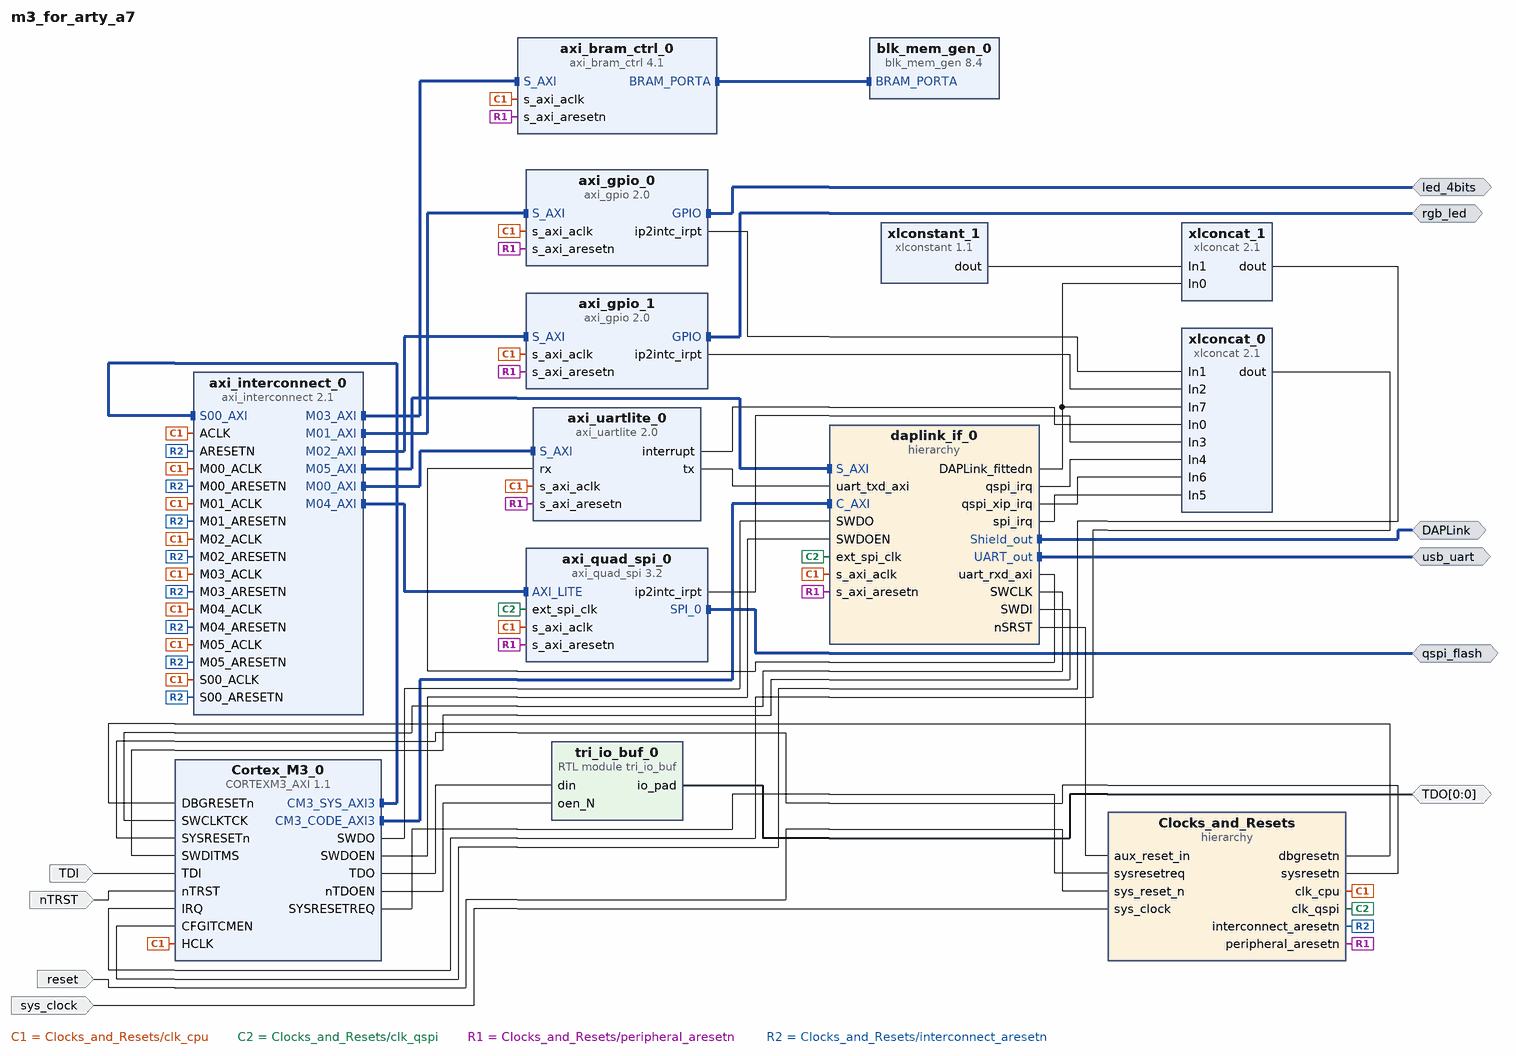
[diagram p0: block diagram of the top level]
# Vivado block design m3_for_arty_a7, xck26-sfvc784-2LV-c, Vivado 2024.2
create_bd_design m3_for_arty_a7

create_bd_intf_port -mode Master -vlnv xilinx.com:interface:gpio_rtl:1.0 DAPLink
create_bd_intf_port -mode Master -vlnv xilinx.com:interface:gpio_rtl:1.0 led_4bits
create_bd_intf_port -mode Master -vlnv xilinx.com:interface:spi_rtl:1.0 qspi_flash
create_bd_intf_port -mode Master -vlnv xilinx.com:interface:gpio_rtl:1.0 rgb_led
create_bd_intf_port -mode Master -vlnv xilinx.com:interface:uart_rtl:1.0 usb_uart
create_bd_port -dir IO -from 0 -to 0 TDO
create_bd_port -dir I -type clk sys_clock
set_property -dict {CONFIG.FREQ_HZ 100000000 CONFIG.PHASE 0.000} [get_bd_ports sys_clock]
create_bd_port -dir I TDI
create_bd_port -dir I nTRST
create_bd_port -dir I -type rst reset
set_property -dict {CONFIG.POLARITY ACTIVE_LOW} [get_bd_ports reset]

create_bd_cell -type hier Clocks_and_Resets
create_bd_cell -type ip -vlnv xilinx.com:ip:axi_bram_ctrl:4.1 axi_bram_ctrl_0
set_property -dict {CONFIG.PROTOCOL AXI4LITE CONFIG.SINGLE_PORT_BRAM 1} [get_bd_cells axi_bram_ctrl_0]
create_bd_cell -type ip -vlnv xilinx.com:ip:axi_gpio:2.0 axi_gpio_0
set_property -dict [list \
  CONFIG.C_INTERRUPT_PRESENT 1 \
  CONFIG.GPIO2_BOARD_INTERFACE Custom \
  CONFIG.GPIO_BOARD_INTERFACE Custom \
  CONFIG.USE_BOARD_FLOW true \
] [get_bd_cells axi_gpio_0]
create_bd_cell -type ip -vlnv xilinx.com:ip:axi_gpio:2.0 axi_gpio_1
set_property -dict [list \
  CONFIG.C_INTERRUPT_PRESENT 1 \
  CONFIG.GPIO2_BOARD_INTERFACE Custom \
  CONFIG.GPIO_BOARD_INTERFACE Custom \
  CONFIG.USE_BOARD_FLOW true \
] [get_bd_cells axi_gpio_1]
create_bd_cell -type ip -vlnv xilinx.com:ip:axi_interconnect:2.1 axi_interconnect_0
set_property -dict [list \
  CONFIG.ENABLE_ADVANCED_OPTIONS 1 \
  CONFIG.M00_HAS_DATA_FIFO 0 \
  CONFIG.M00_HAS_REGSLICE 0 \
  CONFIG.M00_SECURE 0 \
  CONFIG.M01_HAS_DATA_FIFO 0 \
  CONFIG.M01_HAS_REGSLICE 3 \
  CONFIG.M01_SECURE 0 \
  CONFIG.M02_HAS_REGSLICE 3 \
  CONFIG.M02_SECURE 0 \
  CONFIG.M03_HAS_REGSLICE 3 \
  CONFIG.M04_HAS_REGSLICE 3 \
  CONFIG.M05_HAS_REGSLICE 3 \
  CONFIG.NUM_MI 6 \
  CONFIG.NUM_SI 1 \
  CONFIG.S00_HAS_REGSLICE 3 \
  CONFIG.S01_HAS_DATA_FIFO 1 \
  CONFIG.S01_HAS_REGSLICE 3 \
  CONFIG.SYNCHRONIZATION_STAGES 2 \
] [get_bd_cells axi_interconnect_0]
create_bd_cell -type ip -vlnv xilinx.com:ip:axi_quad_spi:3.2 axi_quad_spi_0
set_property -dict [list \
  CONFIG.C_FAMILY artix7 \
  CONFIG.C_FIFO_DEPTH 256 \
  CONFIG.C_SUB_FAMILY artix7 \
  CONFIG.C_USE_STARTUP 1 \
  CONFIG.QSPI_BOARD_INTERFACE Custom \
  CONFIG.UC_FAMILY 0 \
  CONFIG.USE_BOARD_FLOW true \
] [get_bd_cells axi_quad_spi_0]
create_bd_cell -type ip -vlnv xilinx.com:ip:axi_uartlite:2.0 axi_uartlite_0
set_property -dict [list \
  CONFIG.C_BAUDRATE 115200 \
  CONFIG.C_S_AXI_ACLK_FREQ_HZ 50000000 \
  CONFIG.UARTLITE_BOARD_INTERFACE Custom \
  CONFIG.USE_BOARD_FLOW true \
] [get_bd_cells axi_uartlite_0]
create_bd_cell -type ip -vlnv xilinx.com:ip:blk_mem_gen:8.4 blk_mem_gen_0
set_property -dict {CONFIG.EN_SAFETY_CKT false} [get_bd_cells blk_mem_gen_0]
create_bd_cell -type hier daplink_if_0
create_bd_cell -type module -reference tri_io_buf tri_io_buf_0
create_bd_cell -type ip -vlnv xilinx.com:ip:xlconcat:2.1 xlconcat_0
set_property -dict {CONFIG.NUM_PORTS 8 CONFIG.dout_width 8} [get_bd_cells xlconcat_0]
create_bd_cell -type ip -vlnv xilinx.com:ip:xlconcat:2.1 xlconcat_1
set_property -dict {CONFIG.IN6_WIDTH 25 CONFIG.NUM_PORTS 2} [get_bd_cells xlconcat_1]
create_bd_cell -type ip -vlnv xilinx.com:ip:xlconstant:1.1 xlconstant_1
set_property -dict {CONFIG.CONST_VAL 1 CONFIG.CONST_WIDTH 1} [get_bd_cells xlconstant_1]
create_bd_cell -type ip -vlnv Arm.com:CortexM:CORTEXM3_AXI:1.1 Cortex_M3_0
set_property -dict [list \
  CONFIG.DEBUG_LVL 2 \
  CONFIG.DTCM_SIZE {"1011"} \
  CONFIG.ITCM_INIT_FILE bram_a7.hex \
  CONFIG.ITCM_SIZE {"1011"} \
  CONFIG.TRACE_LVL 1 \
  CONFIG.WIC_PRESENT false \
] [get_bd_cells Cortex_M3_0]

# ---- hierarchy /Clocks_and_Resets ----
current_bd_instance /Clocks_and_Resets
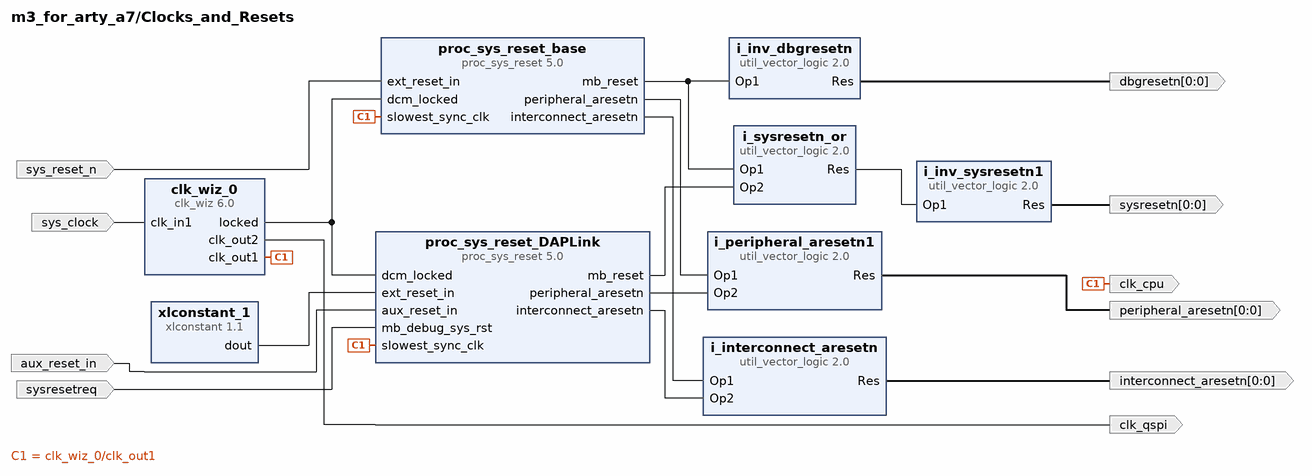
[diagram p1: block diagram inside /Clocks_and_Resets]
create_bd_pin -dir I -type rst aux_reset_in
create_bd_pin -dir O -from 0 -to 0 -type rst interconnect_aresetn
create_bd_pin -dir O -from 0 -to 0 -type rst peripheral_aresetn
create_bd_pin -dir O -type clk clk_cpu
create_bd_pin -dir I -type clk sys_clock
create_bd_pin -dir O -from 0 -to 0 sysresetn
create_bd_pin -dir O -from 0 -to 0 dbgresetn
create_bd_pin -dir O clk_qspi
create_bd_pin -dir I sysresetreq
create_bd_pin -dir I -type rst sys_reset_n

create_bd_cell -type ip -vlnv xilinx.com:ip:proc_sys_reset:5.0 proc_sys_reset_DAPLink
set_property -dict [list \
  CONFIG.C_AUX_RST_WIDTH 1 \
  CONFIG.C_EXT_RST_WIDTH 1 \
  CONFIG.RESET_BOARD_INTERFACE Custom \
  CONFIG.USE_BOARD_FLOW true \
] [get_bd_cells proc_sys_reset_DAPLink]
create_bd_cell -type ip -vlnv xilinx.com:ip:proc_sys_reset:5.0 proc_sys_reset_base
create_bd_cell -type ip -vlnv xilinx.com:ip:util_vector_logic:2.0 i_interconnect_aresetn
set_property -dict {CONFIG.C_SIZE 1} [get_bd_cells i_interconnect_aresetn]
create_bd_cell -type ip -vlnv xilinx.com:ip:util_vector_logic:2.0 i_peripheral_aresetn1
set_property -dict {CONFIG.C_SIZE 1} [get_bd_cells i_peripheral_aresetn1]
create_bd_cell -type ip -vlnv xilinx.com:ip:util_vector_logic:2.0 i_sysresetn_or
set_property -dict {CONFIG.C_OPERATION or CONFIG.C_SIZE 1} [get_bd_cells i_sysresetn_or]
create_bd_cell -type ip -vlnv xilinx.com:ip:util_vector_logic:2.0 i_inv_dbgresetn
set_property -dict {CONFIG.C_OPERATION not CONFIG.C_SIZE 1} [get_bd_cells i_inv_dbgresetn]
create_bd_cell -type ip -vlnv xilinx.com:ip:util_vector_logic:2.0 i_inv_sysresetn1
set_property -dict {CONFIG.C_OPERATION not CONFIG.C_SIZE 1} [get_bd_cells i_inv_sysresetn1]
create_bd_cell -type ip -vlnv xilinx.com:ip:clk_wiz:6.0 clk_wiz_0
set_property -dict [list \
  CONFIG.CLKIN1_JITTER_PS 833.33 \
  CONFIG.CLKIN2_JITTER_PS 833.33 \
  CONFIG.CLKOUT1_DRIVES BUFGCE \
  CONFIG.CLKOUT1_JITTER 151.636 \
  CONFIG.CLKOUT1_PHASE_ERROR 98.575 \
  CONFIG.CLKOUT1_REQUESTED_OUT_FREQ 50.0 \
  CONFIG.CLKOUT2_DRIVES BUFGCE \
  CONFIG.CLKOUT2_JITTER 151.636 \
  CONFIG.CLKOUT2_PHASE_ERROR 98.575 \
  CONFIG.CLKOUT2_REQUESTED_OUT_FREQ 50.0 \
  CONFIG.CLKOUT2_USED true \
  CONFIG.CLKOUT3_DRIVES BUFGCE \
  CONFIG.CLKOUT4_DRIVES BUFGCE \
  CONFIG.CLKOUT5_DRIVES BUFGCE \
  CONFIG.CLKOUT6_DRIVES BUFGCE \
  CONFIG.CLKOUT7_DRIVES BUFGCE \
  CONFIG.CLK_IN1_BOARD_INTERFACE sys_clock \
  CONFIG.CLK_IN2_BOARD_INTERFACE Custom \
  CONFIG.FEEDBACK_SOURCE FDBK_AUTO \
  CONFIG.MMCM_CLKFBOUT_MULT_F 12.000 \
  CONFIG.MMCM_CLKIN1_PERIOD 10.000 \
  CONFIG.MMCM_CLKIN2_PERIOD 10.000 \
  CONFIG.MMCM_CLKOUT0_DIVIDE_F 24.000 \
  CONFIG.MMCM_CLKOUT1_DIVIDE 24 \
  CONFIG.MMCM_COMPENSATION AUTO \
  CONFIG.MMCM_DIVCLK_DIVIDE 1 \
  CONFIG.NUM_OUT_CLKS 2 \
  CONFIG.PHASESHIFT_MODE WAVEFORM \
  CONFIG.RESET_BOARD_INTERFACE Custom \
  CONFIG.SECONDARY_SOURCE Single_ended_clock_capable_pin \
  CONFIG.USE_BOARD_FLOW true \
  CONFIG.USE_INCLK_SWITCHOVER false \
  CONFIG.USE_PHASE_ALIGNMENT true \
  CONFIG.USE_RESET false \
  CONFIG.USE_SAFE_CLOCK_STARTUP true \
] [get_bd_cells clk_wiz_0]
create_bd_cell -type ip -vlnv xilinx.com:ip:xlconstant:1.1 xlconstant_1

# ---- hierarchy /daplink_if_0 ----
current_bd_instance /daplink_if_0
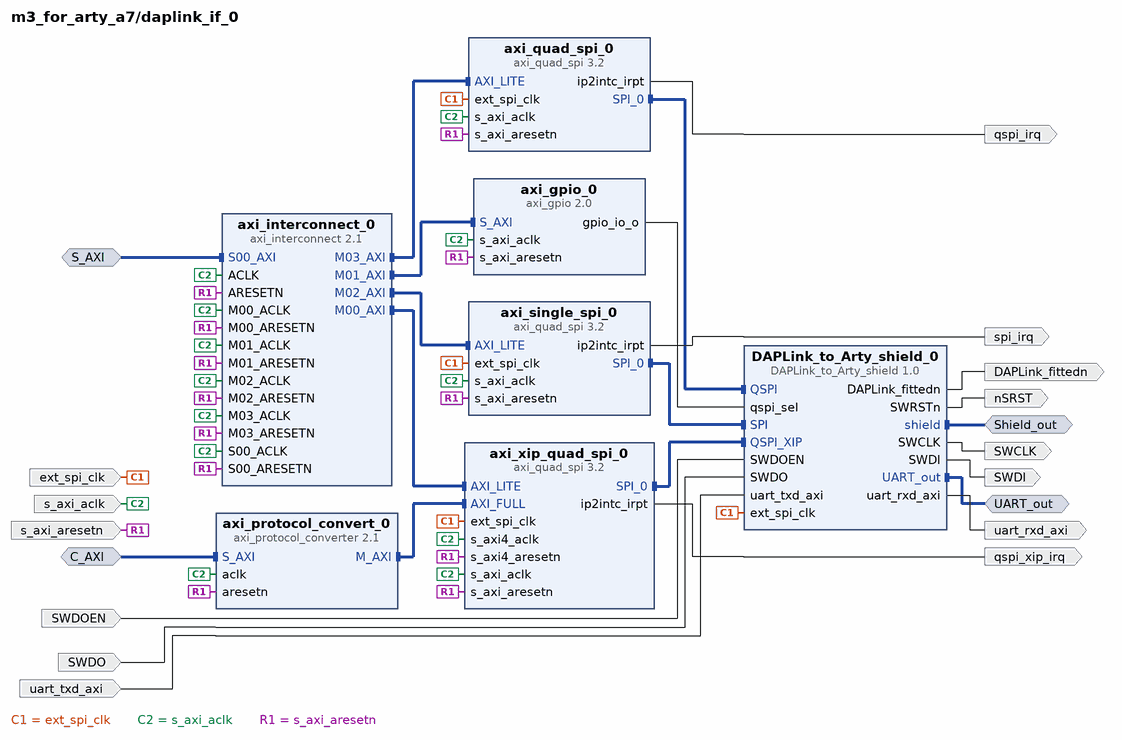
[diagram p2: block diagram inside /daplink_if_0]
create_bd_intf_pin -mode Slave -vlnv xilinx.com:interface:aximm_rtl:1.0 S_AXI
create_bd_intf_pin -mode Master -vlnv xilinx.com:interface:uart_rtl:1.0 UART_out
create_bd_intf_pin -mode Master -vlnv xilinx.com:interface:gpio_rtl:1.0 Shield_out
create_bd_intf_pin -mode Slave -vlnv xilinx.com:interface:aximm_rtl:1.0 C_AXI
create_bd_pin -dir I s_axi_aclk
create_bd_pin -dir I s_axi_aresetn
create_bd_pin -dir O DAPLink_fittedn
create_bd_pin -dir O qspi_irq
create_bd_pin -dir I ext_spi_clk
create_bd_pin -dir O uart_rxd_axi
create_bd_pin -dir O SWDI
create_bd_pin -dir O SWCLK
create_bd_pin -dir O nSRST
create_bd_pin -dir I SWDOEN
create_bd_pin -dir I SWDO
create_bd_pin -dir I uart_txd_axi
create_bd_pin -dir O spi_irq
create_bd_pin -dir O qspi_xip_irq

create_bd_cell -type ip -vlnv xilinx.com:ip:axi_interconnect:2.1 axi_interconnect_0
set_property -dict {CONFIG.NUM_MI 4} [get_bd_cells axi_interconnect_0]
create_bd_cell -type ip -vlnv xilinx.com:ip:axi_quad_spi:3.2 axi_single_spi_0
set_property -dict [list \
  CONFIG.C_FAMILY artix7 \
  CONFIG.C_FIFO_DEPTH 256 \
  CONFIG.C_SUB_FAMILY artix7 \
  CONFIG.C_USE_STARTUP 0 \
  CONFIG.UC_FAMILY 0 \
] [get_bd_cells axi_single_spi_0]
create_bd_cell -type ip -vlnv xilinx.com:ip:axi_quad_spi:3.2 axi_quad_spi_0
set_property -dict [list \
  CONFIG.C_FAMILY artix7 \
  CONFIG.C_FIFO_DEPTH 256 \
  CONFIG.C_SPI_MODE 2 \
  CONFIG.C_SUB_FAMILY artix7 \
  CONFIG.C_USE_STARTUP 0 \
  CONFIG.UC_FAMILY 0 \
] [get_bd_cells axi_quad_spi_0]
create_bd_cell -type ip -vlnv xilinx.com:ip:axi_quad_spi:3.2 axi_xip_quad_spi_0
set_property -dict [list \
  CONFIG.C_FAMILY artix7 \
  CONFIG.C_SPI_MEMORY 3 \
  CONFIG.C_SPI_MEM_ADDR_BITS 24 \
  CONFIG.C_SPI_MODE 2 \
  CONFIG.C_SUB_FAMILY artix7 \
  CONFIG.C_S_AXI4_ID_WIDTH 0 \
  CONFIG.C_TYPE_OF_AXI4_INTERFACE 1 \
  CONFIG.C_USE_STARTUP 0 \
  CONFIG.C_XIP_MODE 1 \
  CONFIG.UC_FAMILY 0 \
] [get_bd_cells axi_xip_quad_spi_0]
create_bd_cell -type ip -vlnv xilinx.com:ip:axi_gpio:2.0 axi_gpio_0
create_bd_cell -type ip -vlnv xilinx.com:ip:axi_protocol_converter:2.1 axi_protocol_convert_0
create_bd_cell -type ip -vlnv Arm.com:user:DAPLink_to_Arty_shield:1.0 DAPLink_to_Arty_shield_0

# ---- connections ----

current_bd_instance /Clocks_and_Resets
connect_bd_net [get_bd_pins aux_reset_in] [get_bd_pins proc_sys_reset_DAPLink/aux_reset_in]
connect_bd_net [get_bd_pins clk_wiz_0/clk_out1] \
  [get_bd_pins clk_cpu] [get_bd_pins proc_sys_reset_DAPLink/slowest_sync_clk] \
  [get_bd_pins proc_sys_reset_base/slowest_sync_clk]
connect_bd_net [get_bd_pins clk_wiz_0/clk_out2] [get_bd_pins clk_qspi]
connect_bd_net -net dcm_locked_1 [get_bd_pins clk_wiz_0/locked] \
  [get_bd_pins proc_sys_reset_DAPLink/dcm_locked] [get_bd_pins proc_sys_reset_base/dcm_locked]
connect_bd_net [get_bd_pins i_interconnect_aresetn/Res] [get_bd_pins interconnect_aresetn]
connect_bd_net [get_bd_pins i_inv_dbgresetn/Res] [get_bd_pins dbgresetn]
connect_bd_net [get_bd_pins i_inv_sysresetn1/Res] [get_bd_pins sysresetn]
connect_bd_net [get_bd_pins i_peripheral_aresetn1/Res] [get_bd_pins peripheral_aresetn]
connect_bd_net [get_bd_pins i_sysresetn_or/Res] [get_bd_pins i_inv_sysresetn1/Op1]
connect_bd_net [get_bd_pins proc_sys_reset_DAPLink/interconnect_aresetn] [get_bd_pins i_interconnect_aresetn/Op2]
connect_bd_net [get_bd_pins proc_sys_reset_DAPLink/mb_reset] [get_bd_pins i_sysresetn_or/Op2]
connect_bd_net [get_bd_pins proc_sys_reset_DAPLink/peripheral_aresetn] [get_bd_pins i_peripheral_aresetn1/Op2]
connect_bd_net [get_bd_pins proc_sys_reset_base/interconnect_aresetn] [get_bd_pins i_interconnect_aresetn/Op1]
connect_bd_net [get_bd_pins proc_sys_reset_base/mb_reset] [get_bd_pins i_inv_dbgresetn/Op1] [get_bd_pins i_sysresetn_or/Op1]
connect_bd_net [get_bd_pins proc_sys_reset_base/peripheral_aresetn] [get_bd_pins i_peripheral_aresetn1/Op1]
connect_bd_net [get_bd_pins sys_clock] [get_bd_pins clk_wiz_0/clk_in1]
connect_bd_net [get_bd_pins sys_reset_n] [get_bd_pins proc_sys_reset_base/ext_reset_in]
connect_bd_net [get_bd_pins sysresetreq] [get_bd_pins proc_sys_reset_DAPLink/mb_debug_sys_rst]
connect_bd_net -net xlconstant_0_dout [get_bd_pins xlconstant_1/dout] [get_bd_pins proc_sys_reset_DAPLink/ext_reset_in]

current_bd_instance /daplink_if_0
connect_bd_intf_net [get_bd_intf_pins C_AXI] [get_bd_intf_pins axi_protocol_convert_0/S_AXI]
connect_bd_intf_net [get_bd_intf_pins UART_out] [get_bd_intf_pins DAPLink_to_Arty_shield_0/UART_out]
connect_bd_intf_net [get_bd_intf_pins Shield_out] [get_bd_intf_pins DAPLink_to_Arty_shield_0/shield]
connect_bd_intf_net [get_bd_intf_pins S_AXI] [get_bd_intf_pins axi_interconnect_0/S00_AXI]
connect_bd_intf_net [get_bd_intf_pins axi_interconnect_0/M00_AXI] [get_bd_intf_pins axi_xip_quad_spi_0/AXI_LITE]
connect_bd_intf_net [get_bd_intf_pins axi_interconnect_0/M01_AXI] [get_bd_intf_pins axi_gpio_0/S_AXI]
connect_bd_intf_net [get_bd_intf_pins axi_interconnect_0/M02_AXI] [get_bd_intf_pins axi_single_spi_0/AXI_LITE]
connect_bd_intf_net [get_bd_intf_pins axi_interconnect_0/M03_AXI] [get_bd_intf_pins axi_quad_spi_0/AXI_LITE]
connect_bd_intf_net [get_bd_intf_pins axi_xip_quad_spi_0/AXI_FULL] [get_bd_intf_pins axi_protocol_convert_0/M_AXI]
connect_bd_intf_net -intf_net axi_quad_spi_1_SPI_0 [get_bd_intf_pins axi_quad_spi_0/SPI_0] [get_bd_intf_pins DAPLink_to_Arty_shield_0/QSPI]
connect_bd_intf_net [get_bd_intf_pins axi_single_spi_0/SPI_0] [get_bd_intf_pins DAPLink_to_Arty_shield_0/SPI]
connect_bd_intf_net [get_bd_intf_pins DAPLink_to_Arty_shield_0/QSPI_XIP] [get_bd_intf_pins axi_xip_quad_spi_0/SPI_0]
connect_bd_net -net DAPLink_to_Arty_shie_1_DAPLink_fittedn [get_bd_pins DAPLink_to_Arty_shield_0/DAPLink_fittedn] [get_bd_pins DAPLink_fittedn]
connect_bd_net -net DAPLink_to_Arty_shie_1_SWCLK [get_bd_pins DAPLink_to_Arty_shield_0/SWCLK] [get_bd_pins SWCLK]
connect_bd_net -net DAPLink_to_Arty_shie_1_SWDI [get_bd_pins DAPLink_to_Arty_shield_0/SWDI] [get_bd_pins SWDI]
connect_bd_net -net DAPLink_to_Arty_shie_1_SWRSTn [get_bd_pins DAPLink_to_Arty_shield_0/SWRSTn] [get_bd_pins nSRST]
connect_bd_net -net DAPLink_to_Arty_shie_1_uart_rxd_axi [get_bd_pins DAPLink_to_Arty_shield_0/uart_rxd_axi] [get_bd_pins uart_rxd_axi]
connect_bd_net [get_bd_pins SWDOEN] [get_bd_pins DAPLink_to_Arty_shield_0/SWDOEN]
connect_bd_net [get_bd_pins SWDO] [get_bd_pins DAPLink_to_Arty_shield_0/SWDO]
connect_bd_net [get_bd_pins axi_gpio_0/gpio_io_o] [get_bd_pins DAPLink_to_Arty_shield_0/qspi_sel]
connect_bd_net -net axi_quad_spi_1_ip2intc_irpt [get_bd_pins axi_quad_spi_0/ip2intc_irpt] [get_bd_pins qspi_irq]
connect_bd_net [get_bd_pins axi_single_spi_0/ip2intc_irpt] [get_bd_pins spi_irq]
connect_bd_net [get_bd_pins axi_xip_quad_spi_0/ip2intc_irpt] [get_bd_pins qspi_xip_irq]
connect_bd_net [get_bd_pins ext_spi_clk] \
  [get_bd_pins DAPLink_to_Arty_shield_0/ext_spi_clk] [get_bd_pins axi_quad_spi_0/ext_spi_clk] \
  [get_bd_pins axi_single_spi_0/ext_spi_clk] [get_bd_pins axi_xip_quad_spi_0/ext_spi_clk]
connect_bd_net [get_bd_pins s_axi_aclk] \
  [get_bd_pins axi_gpio_0/s_axi_aclk] [get_bd_pins axi_interconnect_0/ACLK] [get_bd_pins axi_interconnect_0/S00_ACLK] \
  [get_bd_pins axi_interconnect_0/M00_ACLK] [get_bd_pins axi_interconnect_0/M01_ACLK] \
  [get_bd_pins axi_interconnect_0/M02_ACLK] [get_bd_pins axi_interconnect_0/M03_ACLK] \
  [get_bd_pins axi_protocol_convert_0/aclk] [get_bd_pins axi_quad_spi_0/s_axi_aclk] [get_bd_pins axi_single_spi_0/s_axi_aclk] \
  [get_bd_pins axi_xip_quad_spi_0/s_axi_aclk] [get_bd_pins axi_xip_quad_spi_0/s_axi4_aclk]
connect_bd_net [get_bd_pins s_axi_aresetn] \
  [get_bd_pins axi_gpio_0/s_axi_aresetn] [get_bd_pins axi_interconnect_0/ARESETN] \
  [get_bd_pins axi_interconnect_0/S00_ARESETN] [get_bd_pins axi_interconnect_0/M00_ARESETN] \
  [get_bd_pins axi_interconnect_0/M01_ARESETN] [get_bd_pins axi_interconnect_0/M02_ARESETN] \
  [get_bd_pins axi_interconnect_0/M03_ARESETN] [get_bd_pins axi_protocol_convert_0/aresetn] \
  [get_bd_pins axi_quad_spi_0/s_axi_aresetn] [get_bd_pins axi_single_spi_0/s_axi_aresetn] \
  [get_bd_pins axi_xip_quad_spi_0/s_axi_aresetn] [get_bd_pins axi_xip_quad_spi_0/s_axi4_aresetn]
connect_bd_net [get_bd_pins uart_txd_axi] [get_bd_pins DAPLink_to_Arty_shield_0/uart_txd_axi]

current_bd_instance /
connect_bd_intf_net [get_bd_intf_pins Cortex_M3_0/CM3_CODE_AXI3] [get_bd_intf_pins daplink_if_0/C_AXI]
connect_bd_intf_net [get_bd_intf_pins Cortex_M3_0/CM3_SYS_AXI3] [get_bd_intf_pins axi_interconnect_0/S00_AXI]
connect_bd_intf_net [get_bd_intf_pins daplink_if_0/S_AXI] [get_bd_intf_pins axi_interconnect_0/M05_AXI]
connect_bd_intf_net -intf_net V2C_DAPLink_interface_Shield_out [get_bd_intf_ports DAPLink] [get_bd_intf_pins daplink_if_0/Shield_out]
connect_bd_intf_net -intf_net V2C_DAPLink_interface_UART_out [get_bd_intf_ports usb_uart] [get_bd_intf_pins daplink_if_0/UART_out]
connect_bd_intf_net [get_bd_intf_pins axi_bram_ctrl_0/BRAM_PORTA] [get_bd_intf_pins blk_mem_gen_0/BRAM_PORTA]
connect_bd_intf_net [get_bd_intf_ports led_4bits] [get_bd_intf_pins axi_gpio_0/GPIO]
connect_bd_intf_net [get_bd_intf_ports rgb_led] [get_bd_intf_pins axi_gpio_1/GPIO]
connect_bd_intf_net [get_bd_intf_pins axi_uartlite_0/S_AXI] [get_bd_intf_pins axi_interconnect_0/M00_AXI]
connect_bd_intf_net [get_bd_intf_pins axi_gpio_0/S_AXI] [get_bd_intf_pins axi_interconnect_0/M01_AXI]
connect_bd_intf_net [get_bd_intf_pins axi_interconnect_0/M02_AXI] [get_bd_intf_pins axi_gpio_1/S_AXI]
connect_bd_intf_net [get_bd_intf_pins axi_bram_ctrl_0/S_AXI] [get_bd_intf_pins axi_interconnect_0/M03_AXI]
connect_bd_intf_net [get_bd_intf_pins axi_interconnect_0/M04_AXI] [get_bd_intf_pins axi_quad_spi_0/AXI_LITE]
connect_bd_intf_net [get_bd_intf_ports qspi_flash] [get_bd_intf_pins axi_quad_spi_0/SPI_0]
connect_bd_net [get_bd_pins Clocks_and_Resets/dbgresetn] [get_bd_pins Cortex_M3_0/DBGRESETn]
connect_bd_net [get_bd_pins Clocks_and_Resets/sysresetn] [get_bd_pins Cortex_M3_0/SYSRESETn]
connect_bd_net -net CortexM3DbgAXI_0_SWDO [get_bd_pins Cortex_M3_0/SWDO] [get_bd_pins daplink_if_0/SWDO]
connect_bd_net -net CortexM3DbgAXI_0_SWDOEN [get_bd_pins Cortex_M3_0/SWDOEN] [get_bd_pins daplink_if_0/SWDOEN]
connect_bd_net -net CortexM3DbgAXI_0_TDO [get_bd_pins Cortex_M3_0/TDO] [get_bd_pins tri_io_buf_0/din]
connect_bd_net -net CortexM3DbgAXI_0_nTDOEN [get_bd_pins Cortex_M3_0/nTDOEN] [get_bd_pins tri_io_buf_0/oen_N]
connect_bd_net [get_bd_pins Cortex_M3_0/SYSRESETREQ] [get_bd_pins Clocks_and_Resets/sysresetreq]
connect_bd_net [get_bd_ports TDI] [get_bd_pins Cortex_M3_0/TDI]
connect_bd_net -net TDO_out [get_bd_ports TDO] [get_bd_pins tri_io_buf_0/io_pad]
connect_bd_net -net V2C_DAPLink_interface_DAPLink_fittedn [get_bd_pins daplink_if_0/DAPLink_fittedn] \
  [get_bd_pins xlconcat_0/In7] [get_bd_pins xlconcat_1/In0]
connect_bd_net -net V2C_DAPLink_interface_qspi_irq [get_bd_pins daplink_if_0/qspi_irq] [get_bd_pins xlconcat_0/In4]
connect_bd_net -net V2C_DAPLink_interface_qspi_xip_irq [get_bd_pins daplink_if_0/qspi_xip_irq] [get_bd_pins xlconcat_0/In6]
connect_bd_net -net V2C_DAPLink_interface_spi_irq [get_bd_pins daplink_if_0/spi_irq] [get_bd_pins xlconcat_0/In5]
connect_bd_net -net V2C_DAPLink_interface_uart_rxd_axi [get_bd_pins daplink_if_0/uart_rxd_axi] [get_bd_pins axi_uartlite_0/rx]
connect_bd_net [get_bd_pins axi_gpio_0/ip2intc_irpt] [get_bd_pins xlconcat_0/In1]
connect_bd_net [get_bd_pins axi_gpio_1/ip2intc_irpt] [get_bd_pins xlconcat_0/In2]
connect_bd_net [get_bd_pins axi_quad_spi_0/ip2intc_irpt] [get_bd_pins xlconcat_0/In3]
connect_bd_net [get_bd_pins axi_uartlite_0/interrupt] [get_bd_pins xlconcat_0/In0]
connect_bd_net [get_bd_pins axi_uartlite_0/tx] [get_bd_pins daplink_if_0/uart_txd_axi]
connect_bd_net -net clk_wiz_0_clk_out1 [get_bd_pins Clocks_and_Resets/clk_cpu] \
  [get_bd_pins daplink_if_0/s_axi_aclk] [get_bd_pins Cortex_M3_0/HCLK] [get_bd_pins axi_bram_ctrl_0/s_axi_aclk] \
  [get_bd_pins axi_gpio_0/s_axi_aclk] [get_bd_pins axi_gpio_1/s_axi_aclk] [get_bd_pins axi_interconnect_0/ACLK] \
  [get_bd_pins axi_interconnect_0/S00_ACLK] [get_bd_pins axi_interconnect_0/M00_ACLK] \
  [get_bd_pins axi_interconnect_0/M01_ACLK] [get_bd_pins axi_interconnect_0/M02_ACLK] \
  [get_bd_pins axi_interconnect_0/M03_ACLK] [get_bd_pins axi_interconnect_0/M04_ACLK] \
  [get_bd_pins axi_interconnect_0/M05_ACLK] [get_bd_pins axi_quad_spi_0/s_axi_aclk] [get_bd_pins axi_uartlite_0/s_axi_aclk]
connect_bd_net [get_bd_pins daplink_if_0/SWCLK] [get_bd_pins Cortex_M3_0/SWCLKTCK]
connect_bd_net [get_bd_pins daplink_if_0/SWDI] [get_bd_pins Cortex_M3_0/SWDITMS]
connect_bd_net [get_bd_pins daplink_if_0/nSRST] [get_bd_pins Clocks_and_Resets/aux_reset_in]
connect_bd_net -net ext_spi_clk_1 [get_bd_pins Clocks_and_Resets/clk_qspi] \
  [get_bd_pins daplink_if_0/ext_spi_clk] [get_bd_pins axi_quad_spi_0/ext_spi_clk]
connect_bd_net [get_bd_ports nTRST] [get_bd_pins Cortex_M3_0/nTRST]
connect_bd_net -net proc_sys_reset_1_interconnect_aresetn [get_bd_pins Clocks_and_Resets/peripheral_aresetn] \
  [get_bd_pins daplink_if_0/s_axi_aresetn] [get_bd_pins axi_bram_ctrl_0/s_axi_aresetn] [get_bd_pins axi_gpio_0/s_axi_aresetn] \
  [get_bd_pins axi_gpio_1/s_axi_aresetn] [get_bd_pins axi_quad_spi_0/s_axi_aresetn] \
  [get_bd_pins axi_uartlite_0/s_axi_aresetn]
connect_bd_net -net proc_sys_reset_1_peripheral_aresetn [get_bd_pins Clocks_and_Resets/interconnect_aresetn] \
  [get_bd_pins axi_interconnect_0/ARESETN] [get_bd_pins axi_interconnect_0/S00_ARESETN] \
  [get_bd_pins axi_interconnect_0/M00_ARESETN] [get_bd_pins axi_interconnect_0/M01_ARESETN] \
  [get_bd_pins axi_interconnect_0/M02_ARESETN] [get_bd_pins axi_interconnect_0/M03_ARESETN] \
  [get_bd_pins axi_interconnect_0/M04_ARESETN] [get_bd_pins axi_interconnect_0/M05_ARESETN]
connect_bd_net [get_bd_ports reset] [get_bd_pins Clocks_and_Resets/sys_reset_n]
connect_bd_net [get_bd_ports sys_clock] [get_bd_pins Clocks_and_Resets/sys_clock]
connect_bd_net [get_bd_pins xlconcat_0/dout] [get_bd_pins Cortex_M3_0/IRQ]
connect_bd_net [get_bd_pins xlconcat_1/dout] [get_bd_pins Cortex_M3_0/CFGITCMEN]
connect_bd_net [get_bd_pins xlconstant_1/dout] [get_bd_pins xlconcat_1/In1]

# ---- address map ----
assign_bd_address -offset 0x00000000 -range 1M -target_address_space [get_bd_addr_spaces Cortex_M3_0/CM3_CODE_AXI3] [get_bd_addr_segs daplink_if_0/axi_xip_quad_spi_0/aximm/MEM0]
assign_bd_address -offset 0x40000000 -range 64K -target_address_space [get_bd_addr_spaces Cortex_M3_0/CM3_SYS_AXI3] [get_bd_addr_segs daplink_if_0/axi_xip_quad_spi_0/AXI_LITE/Reg]
assign_bd_address -offset 0x40010000 -range 64K -target_address_space [get_bd_addr_spaces Cortex_M3_0/CM3_SYS_AXI3] [get_bd_addr_segs daplink_if_0/axi_gpio_0/S_AXI/Reg]
assign_bd_address -offset 0x40020000 -range 64K -target_address_space [get_bd_addr_spaces Cortex_M3_0/CM3_SYS_AXI3] [get_bd_addr_segs daplink_if_0/axi_quad_spi_0/AXI_LITE/Reg]
assign_bd_address -offset 0x40030000 -range 64K -target_address_space [get_bd_addr_spaces Cortex_M3_0/CM3_SYS_AXI3] [get_bd_addr_segs daplink_if_0/axi_single_spi_0/AXI_LITE/Reg]
assign_bd_address -offset 0x40100000 -range 64K -target_address_space [get_bd_addr_spaces Cortex_M3_0/CM3_SYS_AXI3] [get_bd_addr_segs axi_uartlite_0/S_AXI/Reg]
assign_bd_address -offset 0x40110000 -range 64K -target_address_space [get_bd_addr_spaces Cortex_M3_0/CM3_SYS_AXI3] [get_bd_addr_segs axi_gpio_0/S_AXI/Reg]
assign_bd_address -offset 0x40120000 -range 64K -target_address_space [get_bd_addr_spaces Cortex_M3_0/CM3_SYS_AXI3] [get_bd_addr_segs axi_gpio_1/S_AXI/Reg]
assign_bd_address -offset 0x40130000 -range 64K -target_address_space [get_bd_addr_spaces Cortex_M3_0/CM3_SYS_AXI3] [get_bd_addr_segs axi_quad_spi_0/AXI_LITE/Reg]
assign_bd_address -offset 0x60000000 -range 8K -target_address_space [get_bd_addr_spaces Cortex_M3_0/CM3_SYS_AXI3] [get_bd_addr_segs axi_bram_ctrl_0/S_AXI/Mem0]

validate_bd_design
save_bd_design
